# EasyEDA Pro project ProProject_keyboard_Tassel43_2024-03-30.epro, board C口分离模块
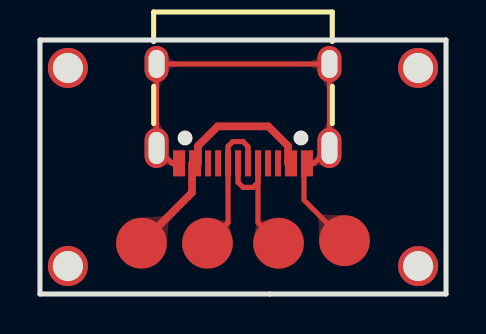
[diagram p9: board, top side]
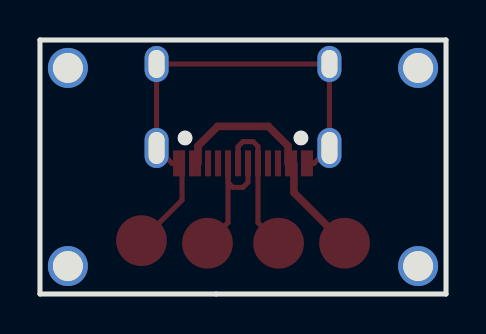
[diagram p10: board, bottom side, seen from below]

Outline 20.32 x 12.7 mm; copper layers: Top Layer, Bottom Layer. Coordinates in mm from the lower left corner of the outline.
Outline path: 0,12.7 20.32,12.7 20.32,0 0,0 0,12.7
Stack: Top Layer 0.035mm / Dielectric1 1.51mm FR4 er 4.5 / Bottom Layer 0.035mm

## Design rules (mm)
spacing Default (default): track to track 0.152, other pairs 0 to 0.152
track width Default (default): min 0.254, default 0.254, max 25.4
differential pair differentialPair (default): width min 0.127, default 0.254, max 2.54; gap min 0.152, default 0.152
via Default (default): diameter min 0.61, default 0.61, max 100.025; hole min 0.305, default 0.305, max 59.995
net GND uses gge2823(1)
pour e80 uses gge2823(1)

## Placement (name value [footprint] x y rotation side)
NOREF  -  [Pad_e47]  15.24 2.67 180 top
NOREF#2  -  [Pad_e50]  5.08 2.54 180 top
NOREF#3  -  [Pad_e81]  1.4 11.3 0 top
NOREF#4  -  [Pad_e49]  8.38 2.54 180 top
NOREF#5  -  [Pad_e48]  11.94 2.54 180 top
NOREF#6  -  [Pad_e84]  18.92 1.4 0 top
NOREF#7  -  [Pad_e83]  1.4 1.4 0 top
NOREF#8  -  [Pad_e82]  18.92 11.3 0 top
USBC2  TYPE-C-31-M-12  [USB-C_SMD-TYPE-C-31-M-12]  10.16 9.02 180 top

## Footprints (pads in the part's own frame, mm; a bottom-side part is the same pattern mirrored in y, then rotated)
Pad_e47
  round 2.54 smd: 1(0,0)
Pad_e48
  round 2.54 smd: 2(0,0)
Pad_e49
  round 2.54 smd: 3(0,0)
Pad_e50
  round 2.54 smd: 1(0,0)
Pad_e81
  round 2 hole 1.5: 4(0,0)
Pad_e82
  round 2 hole 1.5: 5(0,0)
Pad_e83
  round 2 hole 1.5: 6(0,0)
Pad_e84
  round 2 hole 1.5: 7(0,0)
USB-C_SMD-TYPE-C-31-M-12
  oval 1.2x1.8 hole 0.8x1.4: 0(4.325,-2.484) 3(-4.325,-2.484)
  oval 1.2x2 hole 0.8x1.6: 1(4.325,1.716) 2(-4.325,1.716)
  rect 0.3x1.3 smd: A1(-3.35,2.484) A4(-2.55,2.484) A5(-1.25,2.484) A6(-0.25,2.484) A7(0.25,2.484) A8(1.25,2.484) A9(2.55,2.484) A12(3.35,2.485) B1(3.05,2.485) B4(2.25,2.484) B5(1.75,2.484) B6(0.75,2.484) B7(-0.75,2.484) B8(-1.75,2.484) B9(-2.25,2.484) B12(-3.05,2.484)

## Nets
GND: NOREF.1 USBC2.0 USBC2.1 USBC2.2 USBC2.3 USBC2.A1 USBC2.A12 USBC2.B1 USBC2.B12
VBUS: NOREF#2.1 USBC2.A4 USBC2.A9 USBC2.B4 USBC2.B9
D+: NOREF#4.3 USBC2.A6 USBC2.B6
D-: NOREF#5.2 USBC2.A7 USBC2.B7

Pads without a net: NOREF#3 4; NOREF#6 7; NOREF#7 6; NOREF#8 5; USBC2 A5 A8 B5 B8

## Routing (per net, layer and track width the routed paths; a pad name or vN(x,y) marks a point on that pad's centre or on a via; arc(x,y) is an arc through that point)
GND: length 24.9
  Top Layer w0.254: USBC2.B1 USBC2.A12 6.6,6.53 5.83,7.3 5.83,11.5 14.49,11.5 14.49,7.3 13.72,6.53 13.21,6.53 13.21,4.7 NOREF.1
VBUS: length 12.7
  Top Layer w0.254: 7.61,6.53 7.91,6.53 ; 12.71,6.53 12.41,6.53
  Top Layer w0.381: 7.91,6.53 7.91,7.4 8.89,8.38 11.43,8.38 12.41,7.4 12.41,6.53 ; NOREF#2.1 7.61,5.07 7.61,6.53
D+: length 7.3
  Top Layer w0.254: 10.41,6.53 10.41,7.37 10.16,7.62 9.65,7.62 9.41,7.38 9.41,3.57 NOREF#4.3
D-: length 7.5
  Top Layer w0.254: NOREF#5.2 10.91,3.57 10.91,6.53 10.91,5.58 10.67,5.33 10.16,5.33 9.91,5.58 9.91,6.53

## Copper pours and planes (outline as drawn; the poured copper is in the pictures)
GND on Top Layer: -2.54,15.24 22.86,15.24 22.86,-2.54 -2.54,-2.54
GND on Bottom Layer: -2.54,15.24 22.86,15.24 22.86,-2.54 -2.54,-2.54

Small or netless copper shapes (teardrops, artwork), in the pictures only: 29 on Top Layer
